# Altium schematic sheet HS0038_BOARD.SchDoc
size 420 x 297 mm; SheetNumber: 1; SheetTotal: 1
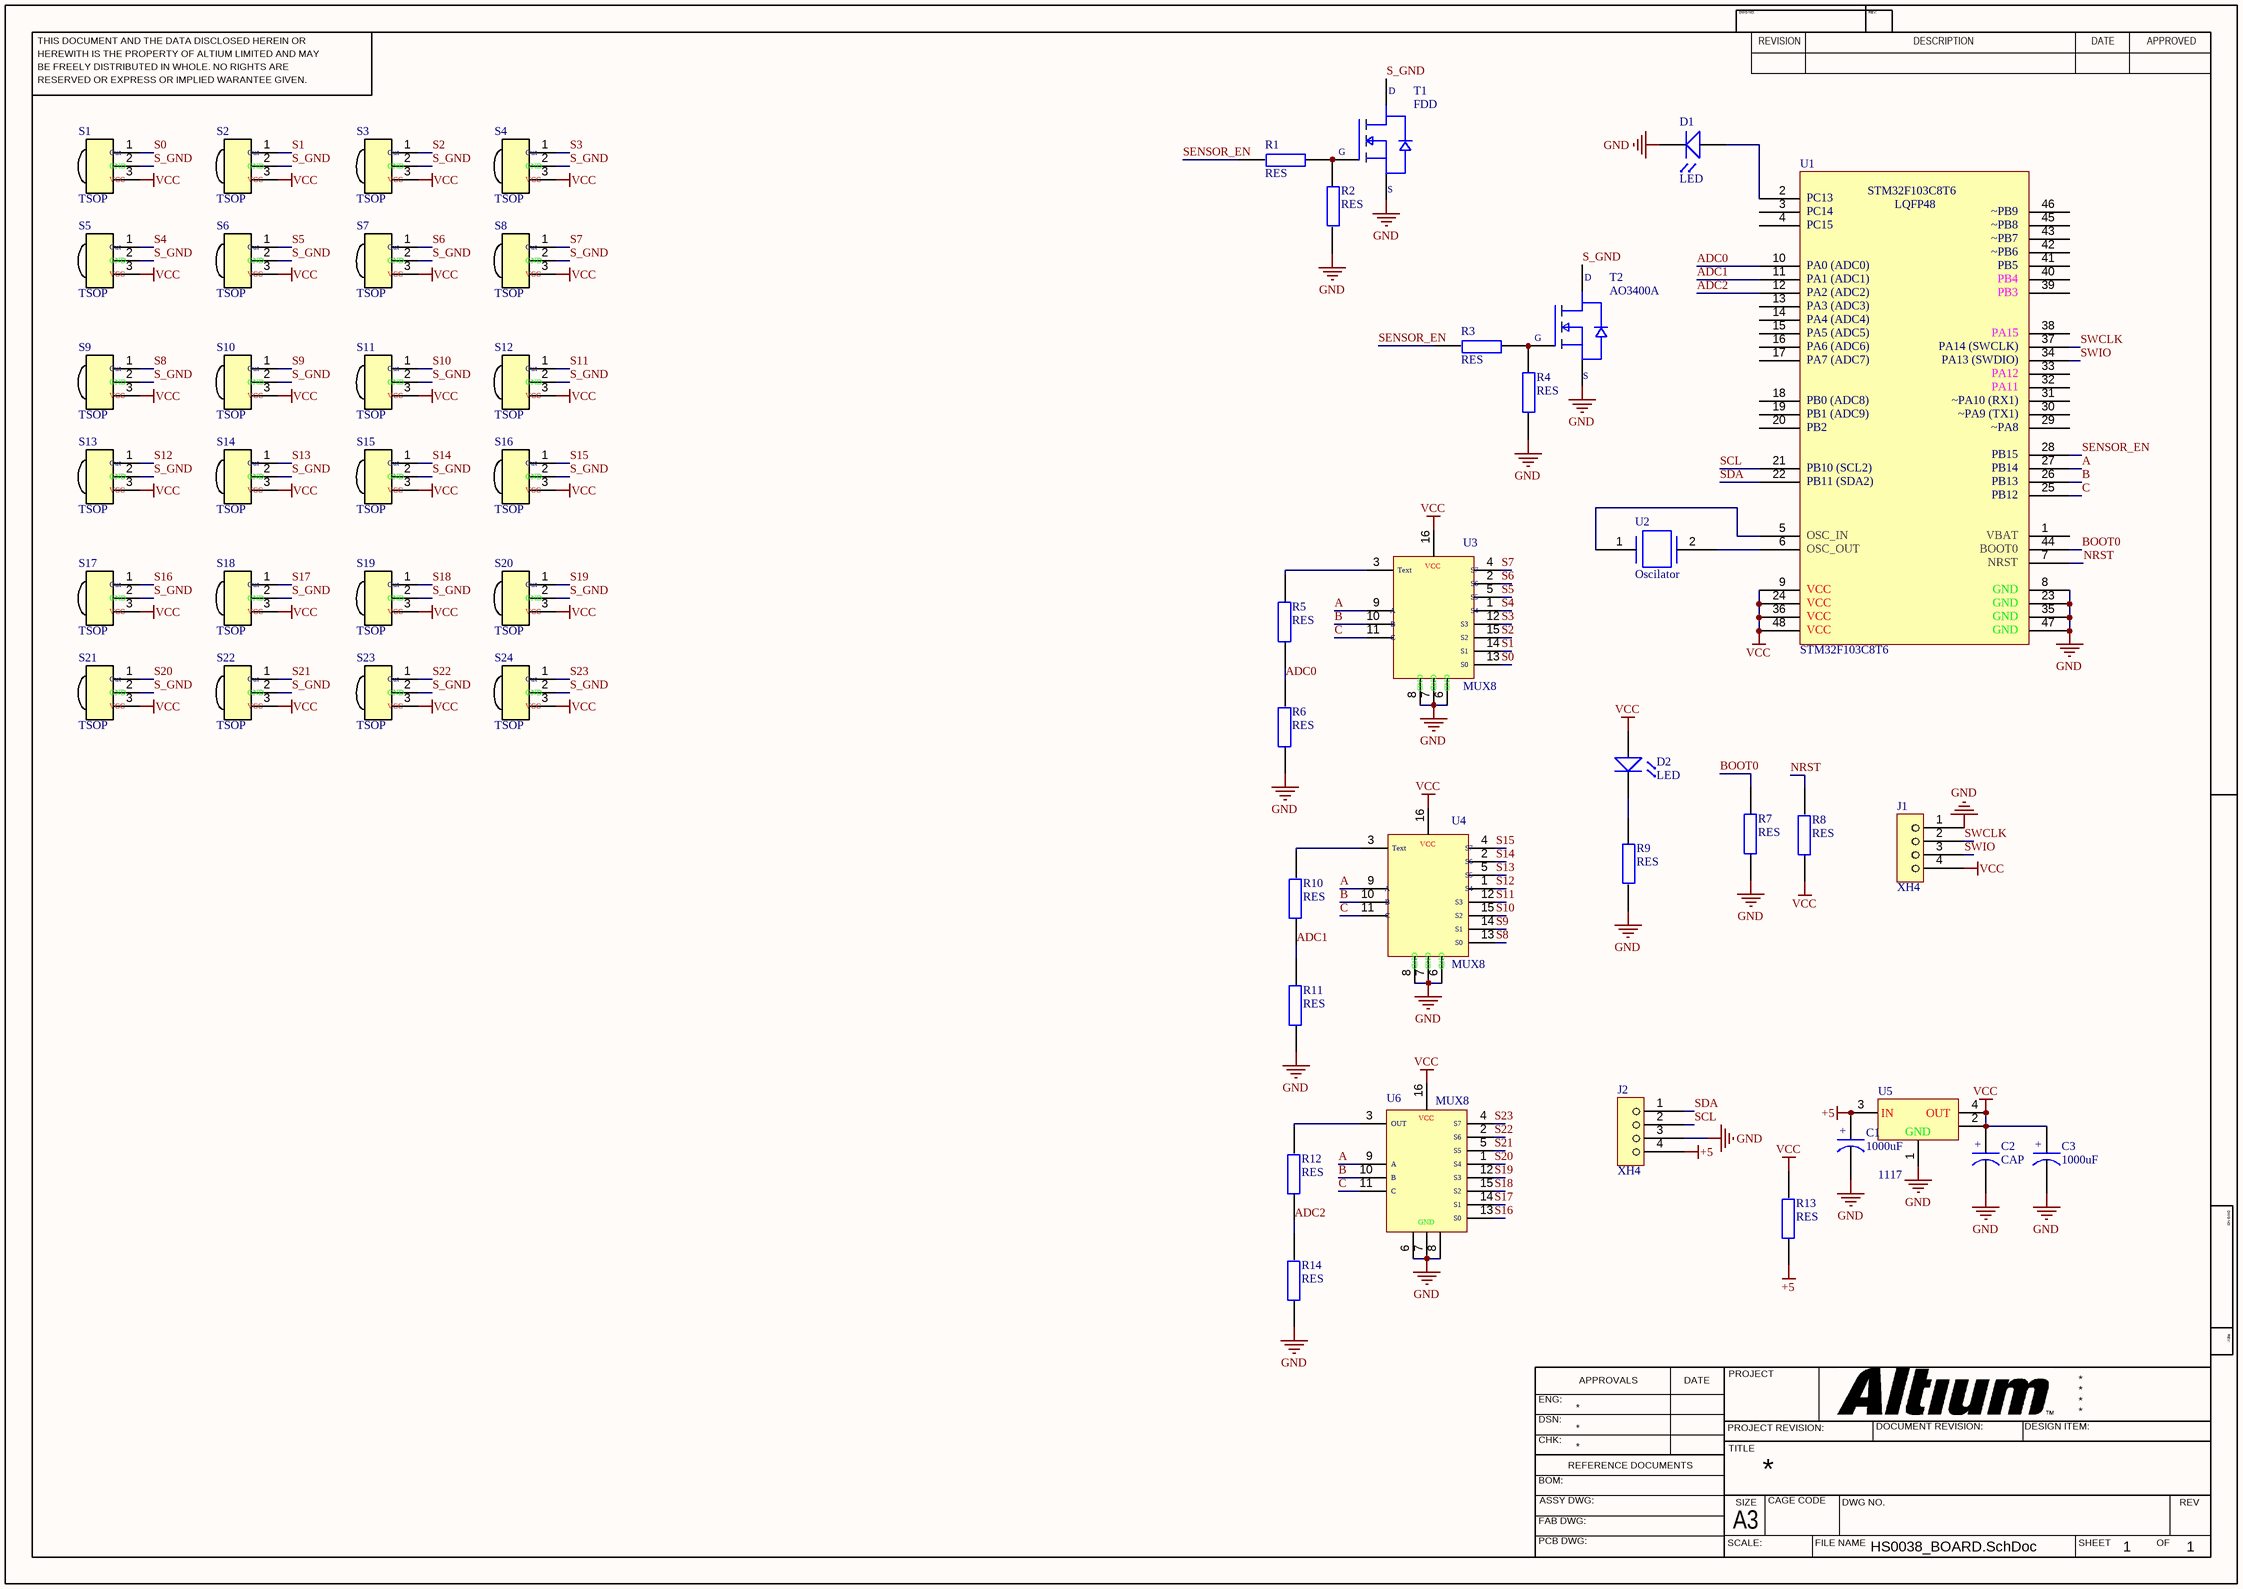
[diagram p0: HS0038_BOARD.SchDoc]

## Parts
C1  1000uF  [CAP 5x10x13 black]
C2  CAP  [CAP SMD 100uF 16V]
C3  1000uF  [CAP 5x10x13 black]
D1  LED  [LED GREEN 1206]
D2  LED  [LED GREEN 1206]
J1  XH4  [XH 4PIN]
J2  XH4  [XH 4PIN]
R1  RES  [RES1206]
R2  RES  [RES1206]
R3  RES  [RES1206]
R4  RES  [RES1206]
R5  RES  [RES1206]
R6  RES  [RES1206]
R7  RES  [RES1206]
R8  RES  [RES1206]
R9  RES  [RES1206]
R10  RES  [RES1206]
R11  RES  [RES1206]
R12  RES  [RES1206]
R13  RES  [RES805]
R14  RES  [RES1206]
S1  TSOP  [TSOP]
S2  TSOP  [TSOP]
S3  TSOP  [TSOP]
S4  TSOP  [TSOP]
S5  TSOP  [TSOP]
S6  TSOP  [TSOP]
S7  TSOP  [TSOP]
S8  TSOP  [TSOP]
S9  TSOP  [TSOP]
S10  TSOP  [TSOP]
S11  TSOP  [TSOP]
S12  TSOP  [TSOP]
S13  TSOP  [TSOP]
S14  TSOP  [TSOP]
S15  TSOP  [TSOP]
S16  TSOP  [TSOP]
S17  TSOP  [TSOP]
S18  TSOP  [TSOP]
S19  TSOP  [TSOP]
S20  TSOP  [TSOP]
S21  TSOP  [TSOP]
S22  TSOP  [TSOP]
S23  TSOP  [TSOP]
S24  TSOP  [TSOP]
T1  FDD  [FDD6690A]
T2  AO3400A  [AO3400A]
U1  STM32F103C8T6  [STM32F103C8T6]
U2  Oscilator  [Crystal Oscilator]
U3  MUX8  [4051 SMD]
U4  MUX8  [4051 SMD]
U5  1117  [AMS1117]
U6  MUX8  [4051 MUX8]

## Nets
+5: C1.2 J2.4 R13.1 U5.3
GND: C1.1 C2.1 C3.1 D1.2 J1.1 J2.3 R2.2 R4.2 R6.1 R7.1 R9.2 R11.1 R14.1 T1.3 T2.2 U1.8 U1.23 U1.35 U1.47 U3.6 U3.7 U3.8 U4.6 U4.7 U4.8 U5.1 U6.6 U6.7 U6.8
VCC: C2.2 C3.2 D2.1 J1.4 R8.1 R13.2 S1.3 S2.3 S3.3 S4.3 S5.3 S6.3 S7.3 S8.3 S9.3 S10.3 S11.3 S12.3 S13.3 S14.3 S15.3 S16.3 S17.3 S18.3 S19.3 S20.3 S21.3 S22.3 S23.3 S24.3 U1.9 U1.24 U1.36 U1.48 U3.16 U4.16 U5.2 U5.4 U6.16
A: U1.27 U3.9 U4.9 U6.9
ADC0: R5.1 R6.2 U1.10
ADC1: R10.1 R11.2 U1.11
ADC2: R12.1 R14.2 U1.12
B: U1.26 U3.10 U4.10 U6.10
BOOT0: R7.2 U1.44
C: U1.25 U3.11 U4.11 U6.11
NRST: R8.2 U1.7
S0: S1.1 U3.13
S1: S2.1 U3.14
S2: S3.1 U3.15
S3: S4.1 U3.12
S4: S5.1 U3.1
S5: S6.1 U3.5
S6: S7.1 U3.2
S7: S8.1 U3.4
S8: S9.1 U4.13
S9: S10.1 U4.14
S10: S11.1 U4.15
S11: S12.1 U4.12
S12: S13.1 U4.1
S13: S14.1 U4.5
S14: S15.1 U4.2
S15: S16.1 U4.4
S16: S17.1 U6.13
S17: S18.1 U6.14
S18: S19.1 U6.15
S19: S20.1 U6.12
S20: S21.1 U6.1
S21: S22.1 U6.5
S22: S23.1 U6.2
S23: S24.1 U6.4
S_GND: S1.2 S2.2 S3.2 S4.2 S5.2 S6.2 S7.2 S8.2 S9.2 S10.2 S11.2 S12.2 S13.2 S14.2 S15.2 S16.2 S17.2 S18.2 S19.2 S20.2 S21.2 S22.2 S23.2 S24.2 T1.4 T2.3
SCL: J2.2 U1.21
SDA: J2.1 U1.22
SENSOR_EN: R1.2 R3.2 U1.28
SWCLK: J1.2 U1.37
SWIO: J1.3 U1.34
NetD1_1: D1.1 U1.2
NetD2_2: D2.2 R9.1
NetR1_1: R1.1 R2.1 T1.1
NetR3_1: R3.1 R4.1 T2.1
NetR5_2: R5.2 U3.3
NetR10_2: R10.2 U4.3
NetR12_2: R12.2 U6.3
NetU1_5: U1.5 U2.1
NetU1_6: U1.6 U2.2

Not connected (* = marked no-connect by the designer): U1 1 3 4 13 14 15 16 17 18 19 20 29 30 31 32 33 38 39 40 41 42 43 45 46

## Notes on the sheet
- THIS DOCUMENT AND THE DATA DISCLOSED HEREIN OR
- HEREWITH IS THE PROPERTY OF ALTIUM LIMITED AND MAY
- DWG NO:
- REVISION
- REV:
- DESCRIPTION
- DATE
- APPROVED
- BE FREELY DISTRIBUTED IN WHOLE. NO RIGHTS ARE
- RESERVED OR EXPRESS OR IMPLIED WARANTEE GIVEN.
- ENG:
- APPROVALS
- PROJECT
- DSN:
- CHK:
- REFERENCE DOCUMENTS
- PROJECT REVISION:
- TITLE
- DOCUMENT REVISION:
- DESIGN ITEM:
- BOM:
- FAB DWG:
- PCB DWG:
- ASSY DWG:
- SCALE:
- A3
- SIZE
- CAGE CODE
- FILE NAME
- DWG NO.
- SHEET
- OF
- REV
- (in symbol 4051) VCC; Text; S7; S6; S5; A; S4; B; S3; C; S2; S1; S0; GND
- (in symbol 4051 MUX8) VCC; OUT; S7; S6; S5; A; S4; B; S3; C; S2; S1; S0; GND
- (in symbol AMS1117) IN; OUT; GND
- (in symbol AO3400A) D; G; S
- (in symbol CAP Electrolit SMD) +
- (in symbol Cap Electrolyte) +
- (in symbol FDD6690A) D; G; S
- (in symbol STM32F103C8T6) PC13; LQFP48; ~PB9; PC14; ~PB8; PC15; ~PB7; ~PB6; PB5; PA0 (ADC0); PB4; PA1 (ADC1); PB3; PA2 (ADC2); PA3 (ADC3); PA4 (ADC4); PA15; PA5 (ADC5); PA14 (SWCLK); PA6 (ADC6); PA13 (SWDIO); PA7 (ADC7); PA12; PA11; ~PA10 (RX1); PB0 (ADC8); ~PA9 (TX1); PB1 (ADC9); ~PA8; PB2; PB15; PB14; PB10 (SCL2); PB13; PB11 (SDA2); PB12; VBAT; OSC_IN; BOOT0; OSC_OUT; NRST; GND; VCC
- (in symbol TSOP) Out; GND; VCC

## Library data of the parts
C1 C3 = Cap Electrolyte: CAP DIP
C2 = CAP Electrolit SMD: Capacitor Electrolit SMD
D1 D2 = LED SMD 1206
J1 J2 = XH 4PIN: XH Connector 4pins
R1-R12 R14 = RES1206: RESISTOR SMD
R13 = RES805: RESISTOR SMD
S1-S24 = TSOP: IR Sensor
T1 = FDD6690A: FDD6690A MOSFET N-Chanel
U1 = STM32F103C8T6: STM32F103C8T6 / LQFP48
U2 = Crystal: Crystal Oscilator 8MHz
U3 U4 = 4051: MULTIPLEXER 8 BIT
U5 = AMS1117: 3.3v Regulator
U6 = 4051 MUX8: 8Bit multiplexer/demultiplexer